# Altium schematic sheet Decade_counter.SchDoc
size A4; SheetNumber: 2; SheetTotal: 2
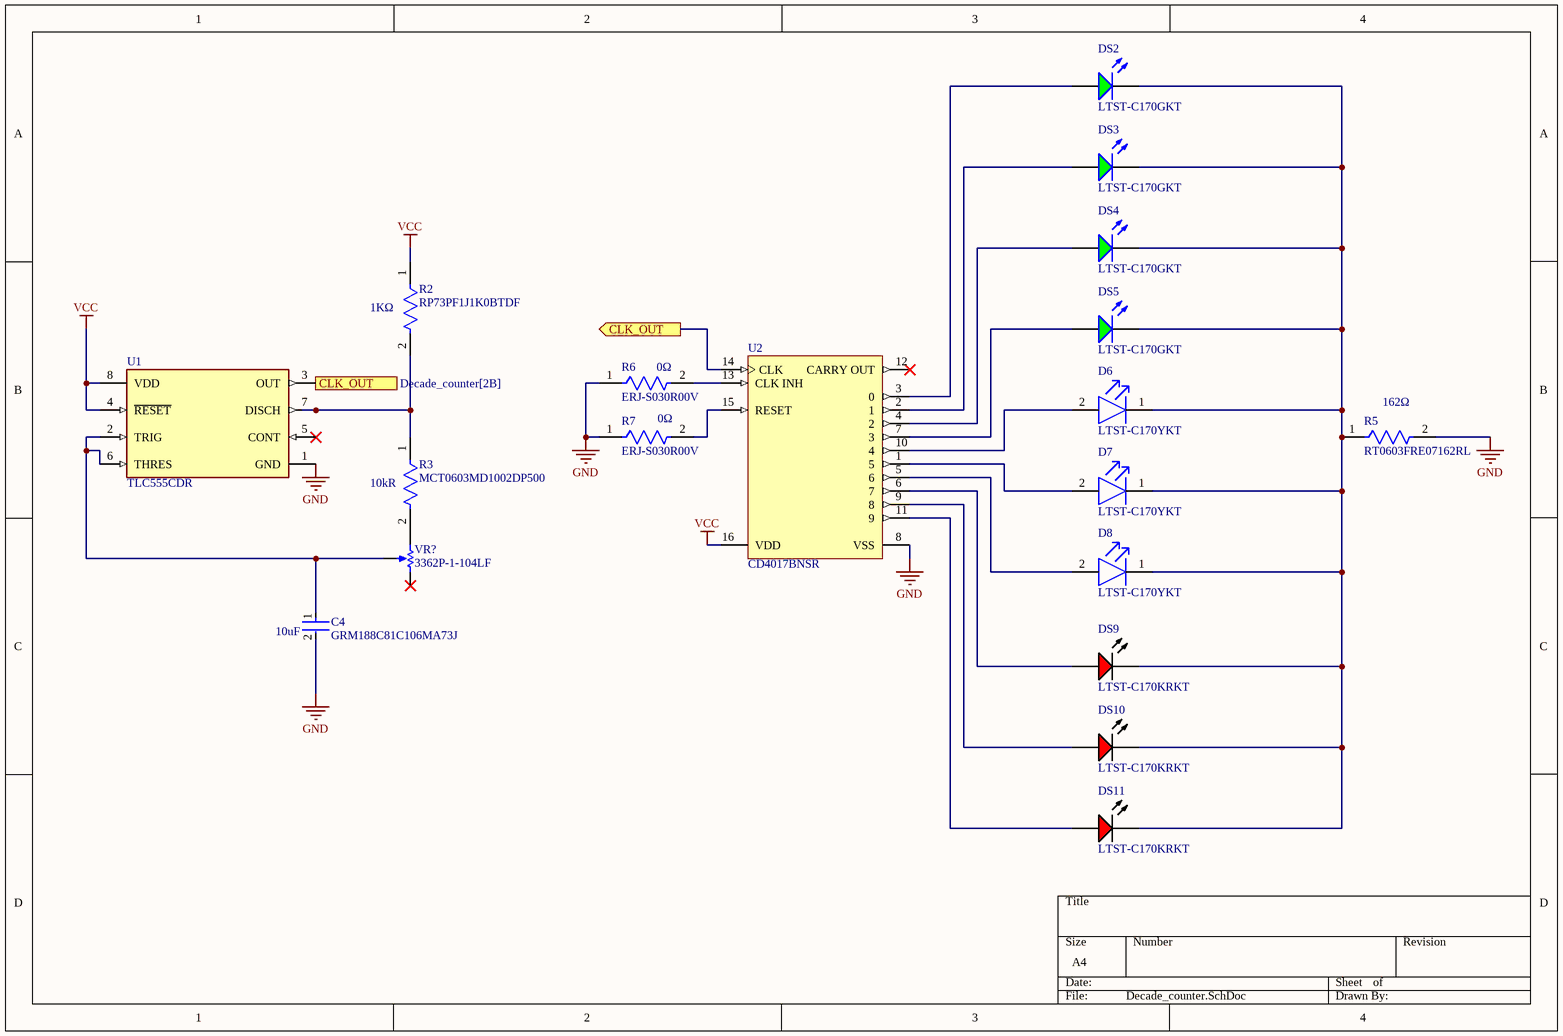
[diagram p0: Decade_counter.SchDoc]

## Parts
C4  GRM188C81C106MA73J  Capacitance: 10uF  [FP-GRM188-0_2-IPC_A]
D6  LTST-C170YKT  [FP-LTST-C170YKT-MFG]
D7  LTST-C170YKT  [FP-LTST-C170YKT-MFG]
D8  LTST-C170YKT  [FP-LTST-C170YKT-MFG]
DS2  LTST-C170GKT  [LTST-C170GKT_V]
DS3  LTST-C170GKT  [LTST-C170GKT_V]
DS4  LTST-C170GKT  [LTST-C170GKT_V]
DS5  LTST-C170GKT  [LTST-C170GKT_V]
DS9  LTST-C170KRKT  [LTST-C170KRKT_V]
DS10  LTST-C170KRKT  [LTST-C170KRKT_V]
DS11  LTST-C170KRKT  [LTST-C170KRKT_V]
R2  RP73PF1J1K0BTDF  value 1KΩ  [FP-RP73P-1J-MFG]
R3  MCT0603MD1002DP500  Resistance: 10kR  [FP-MCT0603-IPC_A]
R5  RT0603FRE07162RL  Resistance: 162Ω  [FP-RT0603-MFG]
R6  ERJ-S030R00V  Resistance: 0Ω  [FP-ERJS03-MFG]
R7  ERJ-S030R00V  Resistance: 0Ω  [FP-ERJS03-MFG]
U1  TLC555CDR  [FP-D0008A-IPC_B]
U2  CD4017BNSR  [NS0016A_M]
VR?  3362P-1-104LF  [BOUR-3362P]

## Ports
CLK_OUT (out), CLK_OUT (out, see Decade_counter[2B])

## Nets
GND: C4.2 R5.2 R6.1 R7.1 U1.1(GND) U2.8(VSS)
VCC: R2.1 U1.4(~{RESET}) U1.8(VDD) U2.16(VDD)
CLK_OUT: U1.3(OUT) U2.14(CLK) ; port CLK_OUT
NetC4_1: C4.1 U1.2(TRIG) U1.6(THRES) VR?.2(S)
NetD6_1: D6.1(C) D7.1(C) D8.1(C) DS2.2(K) DS3.2(K) DS4.2(K) DS5.2(K) DS9.2(K) DS10.2(K) DS11.2(K) R5.1
NetD6_2: D6.2(A) U2.10(4)
NetD7_2: D7.2(A) U2.1(5)
NetD8_2: D8.2(A) U2.5(6)
NetDS2_1: DS2.1(A) U2.3(0)
NetDS3_1: DS3.1(A) U2.2(1)
NetDS4_1: DS4.1(A) U2.4(2)
NetDS5_1: DS5.1(A) U2.7(3)
NetDS9_1: DS9.1(A) U2.6(7)
NetDS10_1: DS10.1(A) U2.9(8)
NetDS11_1: DS11.1(A) U2.11(9)
NetR2_2: R2.2 R3.1 U1.7(DISCH)
NetR3_2: R3.2 VR?.1(CCW)
NetR6_2: R6.2 U2.13(CLK_INH)
NetR7_2: R7.2 U2.15(RESET)

Not connected (* = marked no-connect by the designer): U1 5(CONT)*; U2 12(CARRY_OUT)*; VR? 3(CW)*

## Library data of the parts
C4 = CMP-06035-041220-1: Chip Multilayer Ceramic Capacitors for General Purpose, 0603, 10uF, X6S, 22%, 20%, 16V; Thickness: 0.039inch; Packaging: Tape and Reel; Tolerance: 20%; Min Operating Temperature: -55°C; Mount: Surface Mount; Dielectric: X6S; Case/Package: 0603; Package Quantity: 10000; Length: 0.063inch; Voltage Rating: 16V; Width: 0.031inch; Weight: 0.000222oz; Voltage Rating (DC): 16V; Max Operating Temperature: 105°C
D6-D8 = CMP-1674-00003-7: LED YELLOW CLEAR SMD; Viewing Angle: 130°; Luminous Intensity: 6mcd; Test Current: 10mA; Number of Elements: 1; Forward Current: 20mA; Forward Voltage: 2.1V; Reverse Voltage: 5V; Power Dissipation: 60mW; Lens Style: Diffused; Wavelength: 585nm; Lens Color: Colorless; Dominant Wavelength: 588nm; RoHS Compliant: Yes; Height: 1.1mm; Min Operating Temperature: -55°C; Max Operating Temperature: 85°C; Number of LEDs: 1; Mount: Surface Mount; Radiation Hardening: No; Illumination Color: Yellow; Length: 3.2mm; Series: CHIPLED 0805; Package Quantity: 1; Packaging: Tape and Reel; Color: Yellow; Depth: 1.6mm; Case/Package: 0805; Lens Transparency: Clear; Case Code (Imperial): 0805; Width: 1.25mm; Case Code (Metric): 2012; Lead Free: Lead Free; Power Rating: 60mW; Number of Pins: 2
DS2-DS5 = CMP-1674-00002-5: LED Uni-Color Green, 100 mW, 120 mA, -55 to 85 degC, 2-Pin SMD, RoHS, Tape and Reel; Manufacturer: Lite-On; Lens Color: Colorless; Lens Transparency: Clear; Millicandela Rating: 6mcd; Lens Style/Size: Rectangle with Flat Top, 1.40mm x 1.25mm; Voltage - Forward (Vf) (Typ): 2.1V; Current - Test: 10mA; Viewing Angle: 130°; Wavelength - Dominant: 569nm; Wavelength - Peak: 565nm; ComponentLink1URL: http://www.us.liteon.com/; Height: 1.1 mm; PackageDescription: 2-Pin Surface Mount Device, Body 2 x 1.25 mm; RoHSCompliant: true; Package Quantity: 1; Packaging: Tape and Reel; Mount: Surface Mount; Min Operating Temperature: -55 degC; DatasheetVersion: 03/2003; Max Operating Temperature: 85 degC; ComponentLink1Description: Manufacturer URL; Pins: 2; Mounting Technology: Surface Mount; Length: 2 mm; Colour: Green; PackageReference: C170GKT; ComponentLink2URL: http://media.digikey.com/pdf/Data%20Sheets/Lite-On%20PDFs/LTST-C170GKT.pdf; ComponentLink2Description: Datasheet; Supplier 1: Digi-Key; Supplier Part Number 1: 160-1179-1-ND; Manufacturer Part Number: LTST-C170GKT; RoHS: RoHS Compliant; Category: Optoelectronics; Stock 1: 242288; Pricing 1: 1=0.48, 10=0.351, 25=0.2588, 100=0.1848, 250=0.12564, 500=0.11086, 1000=0.08684 (CAD); Part Status: Active; Color: Green; Mounting Type: Surface Mount; Features: -; Package / Case: 0805 (2012 Metric); Supplier Device Package: -; Size / Dimension: 2.00mm L x 1.25mm W; Height (Max): 1.10mm
DS9-DS11 = CMP-2000-07593-1: LED Red, 75 mW, 54 mcd, -55 to 85 degC, 2-Pin SMD, RoHS, Tape and Reel; Manufacturer: Lite-On; Lens Transparency: Clear; Number of Elements: 1; Power Rating: 75mW; Luminous Intensity: 54mcd; Viewing Angle: 130degrees; Forward Current: 30mA; Wavelength: 639nm; Lens Style: Rectangular; Case\/Package: 0805; Test Current: 20mA; Dominant Wavelength: 631nm; Forward Voltage: 2V; Lens Colour: Colorless; Min Operating Temperature: -55degC; RoHSCompliant: True; Length: 3.2mm; Width: 1.25mm; Mount: SurfaceMount; Packaging: TapeandReel; Number of LEDs: 1; Radiation Hardening: No; Datasheet URL: http://optoelectronics.liteon.com/upload/download/DS-22-99-0150/LTST-C170KRKT.pdf; Datasheet Version: Rev. D, 11/2014; Case Code (Metric): 2012; Height: 1.1mm; Number of Pins: 2; Package Description: 2-Pin Surface Mount Device, Body 2 x 1.25 mm; Manufacturer URL: http://www.us.liteon.com/; Lead Free: LeadFree; Illumination Colour: Red; Colour: Red; Case Code (Imperial): 0805; Max Operating Temperature: 85degC; Power Dissipation: 75mW; Mounting Technology: SurfaceMount; Package Reference: C170KRKT; Package Quantity: 1; Depth: 1.6mm
R2 = CMP-03211-004517-1: RES SMD 1K OHM 0.1% 1/6W 0603; Manufacturer: TE Connectivity; Power Rating: 0.166W; Tolerance: 0.001; Temperature Coefficient: 25ppm/°C; Voltage Rating: 100V; Composition: Thin Film; Category: Res; Temperature Range High: +155°C; Device Class L1: Passive Components; Digikey Description: RES SMD 1K OHM 0.1% 1/6W 0603; Lead Free: Yes; RoHS: TRUE; Ipc Land Pattern Name: RESC15580X45; Automotive: No; Temperature: -55°C to +155°C; Height: 0.55mm; ComponentLink2URL: https://www.te.com/commerce/DocumentDelivery/DDEController?Action=srchrtrv&DocNm=1773272&DocType=DS&DocLang=English; Manufacturer Part Number: RP73PF1J1K0BTDF; Resistance: 1KΩ; ComponentLink2Description: Datasheet; Temperature Range Low: -55°C; Octopart: https://octopart.com/rp73pf1j1k0btdf-te+connectivity-45465729; Device Class L3: Chip SMD Resistors; Series: RP73P; Package: RP73P-1J; Device Class L2: Resistors
R3 = CMP-02407-010942-1: RES SMD 100 OHM 1% 1/8W 0603; Power Rating: 125mW; Tolerance: 0.5%; Temperature Coefficient: 25ppm/°C; Max Power Dissipation: 150mW; Voltage Rating: 75V; Case Code (Imperial): 0603; Case Code (Metric): 1608; Military Standard: Not; Lead Free: Lead Free; Max Operating Temperature: 175°C; Length: 1.55mm; Height: 0.022inch; Min Operating Temperature: -55°C; Width: 0.8mm; Package Quantity: 1; Contact Plating: Tin; Termination: Wraparound; Composition: Thin Film; Case/Package: 0603; Number of Terminations: 2; Depth: 0.85mm; Features: Automotive AEC-Q200; Mount: Surface Mount; Voltage Rating (DC): 75V; Packaging: Tape and Reel; REACH SVHC: No SVHC
R5 = CMP-03412-027968-1: RES SMD 162 OHM 1% 1/10W 0603; Manufacturer: Yageo; Temperature Coefficient: 50 ppm/°C; Power Rating: 0.1W; Voltage Rating: 75V; Tolerance: 0.01; Value: 162Ω; Device Class L2: Resistors; ComponentLink2Description: Datasheet; Lead Free: Yes; Manufacturer Part Number: RT0603FRE07162RL; ComponentLink2URL: http://www.yageo.com/documents/recent/PYu-RT_1-to-0.01_RoHS_L_9.pdf; Automotive: No; Ipc Land Pattern Name: RESC16080X45; Height: 0.55mm; Temperature Range High: +155°C; Category: Res; Footprint Url: http://www.yageo.com/exep/pages/download/literatures/PYu-R_Mount_10.pdf; Series: RT; Composition: Thin Film; Mouser Description: Thin Film Resistors - SMD 1/10W 162 ohm 1% 50ppm; Digikey Description: RES SMD 162 OHM 1% 1/10W 0603; Temperature Range Low: -55°C; Temperature: -55°C to +155°C; Package: RT0603; Device Class L1: Passive Components; Device Class L3: Chip SMD Resistors; RoHS: TRUE; Octopart: https://octopart.com/rt0603fre07162rl-yageo-1483634
R6 R7 = CMP-00287-39831190-1: ERJ-S030R00V Zero Ohm Resistor, Jumper, 0603 [1608 Metric], Thick Film, 100 mW, 1 A, Surface Mount; Voltage Rating (DC): 100V; Max Power Dissipation: 100mW; Temperature Coefficient: 100ppm/°C; Tolerance: 5%; Case Code (Metric): 1608; Case Code (Imperial): 0603; Width: 800µm; Min Operating Temperature: -55°C; Lifecycle Status: Production; Features: Anti-Sulfur; Case/Package: 0603; Number of Terminations: 2; Max Operating Temperature: 155°C; Length: 1.6mm; Mount: Surface Mount; NexarPartId: 39831190; Height: 558.8µm; RoHS: Compliant; Contact Plating: Tin; Power Rating: 100mW; Military Standard: Not; Depth: 800µm; Lead Free: Lead Free; Composition: Thick Film
U1 = CMP-04857-000001-1: IC OSC SGL TIMER 2.1MHZ 8-SOIC; Min Supply Voltage: 2V; Number of Channels: 1; Max Power Dissipation: 725mW; Max Supply Voltage: 15V; Low Level Output Current: 100mA; Current Rating: 250A; Quiescent Current: 250uA; Operating Supply Current: 360uA; High Level Output Current: -10mA; Width: 3.91mm; Case/Package: SOIC; Weight: 0.002561oz; Frequency: 2.1MHz; Height: 1.58mm; Package Quantity: 2500; REACH SVHC: No SVHC; Number of Timers/Counters: 1; Lead Free: Lead Free; Number of Pins: 8; Max Operating Temperature: 125°C; Min Operating Temperature: -40°C; Length: 4.9mm; Radiation Hardening: No; Packaging: Tape and Reel; Termination: SMD/SMT; Mount: Surface Mount; Power Dissipation: 725mW
U2 = CMP-1623-00606-2: CMOS Decade Counter with 10 Decoded Outputs, NS0016A, LARGE T&R; Manufacturer: Texas Instruments; F @ Nom Voltage(Max)(Mhz): 8; Output Drive (IOL/IOH)(Max)(mA): 1.5/-1.5; Bits(#): 10; ICC @ Nom Voltage(Max)(mA): 0.03; Technology Family: CD4000; Schmitt Trigger: No; VCC(Min)(V): 3; Inputs: 1; tpd @ Nom Voltage(Max)(ns): 270; VCC(Max)(V): 18; Rating: Military; Operating Temperature Range(C): -55 to 125; DatasheetVersion: SCHS027C; Input Type: CMOS; Voltage(Nom)(V): 10; PackageReference: NS0016A; Output Type: CMOS; Function: Counter; Type: Decade; Generic Part Number: CD4017B
VR? = CMP-1747-00003-1: Square Trimpot(R) Trimming Potentiometer, 100 KOhm, 300 V, -55 to 125 degC, 3-Pin THD, RoHS, Tube; Voltage Rating: 250 V; Case\Package: Axial; Tolerance: 1%; Power Rating: 250 mW; Resistance: 1 mohm; RoHSCompliant: true; ComponentLink2URL: http://www.bourns.com/docs/Product-Datasheets/3362.pdf; ComponentLink1Description: Manufacturer URL; DatasheetVersion: May-16; Package Quantity: 200; ComponentLink2Description: Datasheet; Min Operating Temperature: -55 degC; Mount: Through Hole; PackageDescription: 3-Pin Through Hole Device, Body 6.6 x 6.99 mm, Pitch 2.54 mm; Length: 0.248 inch; ComponentLink1URL: http://www.bourns.com/; PackageReference: 3326P; Max Operating Temperature: 155 degC; Packaging: Bulk